# EAGLE design untitled (EAGLE 9.6.2)
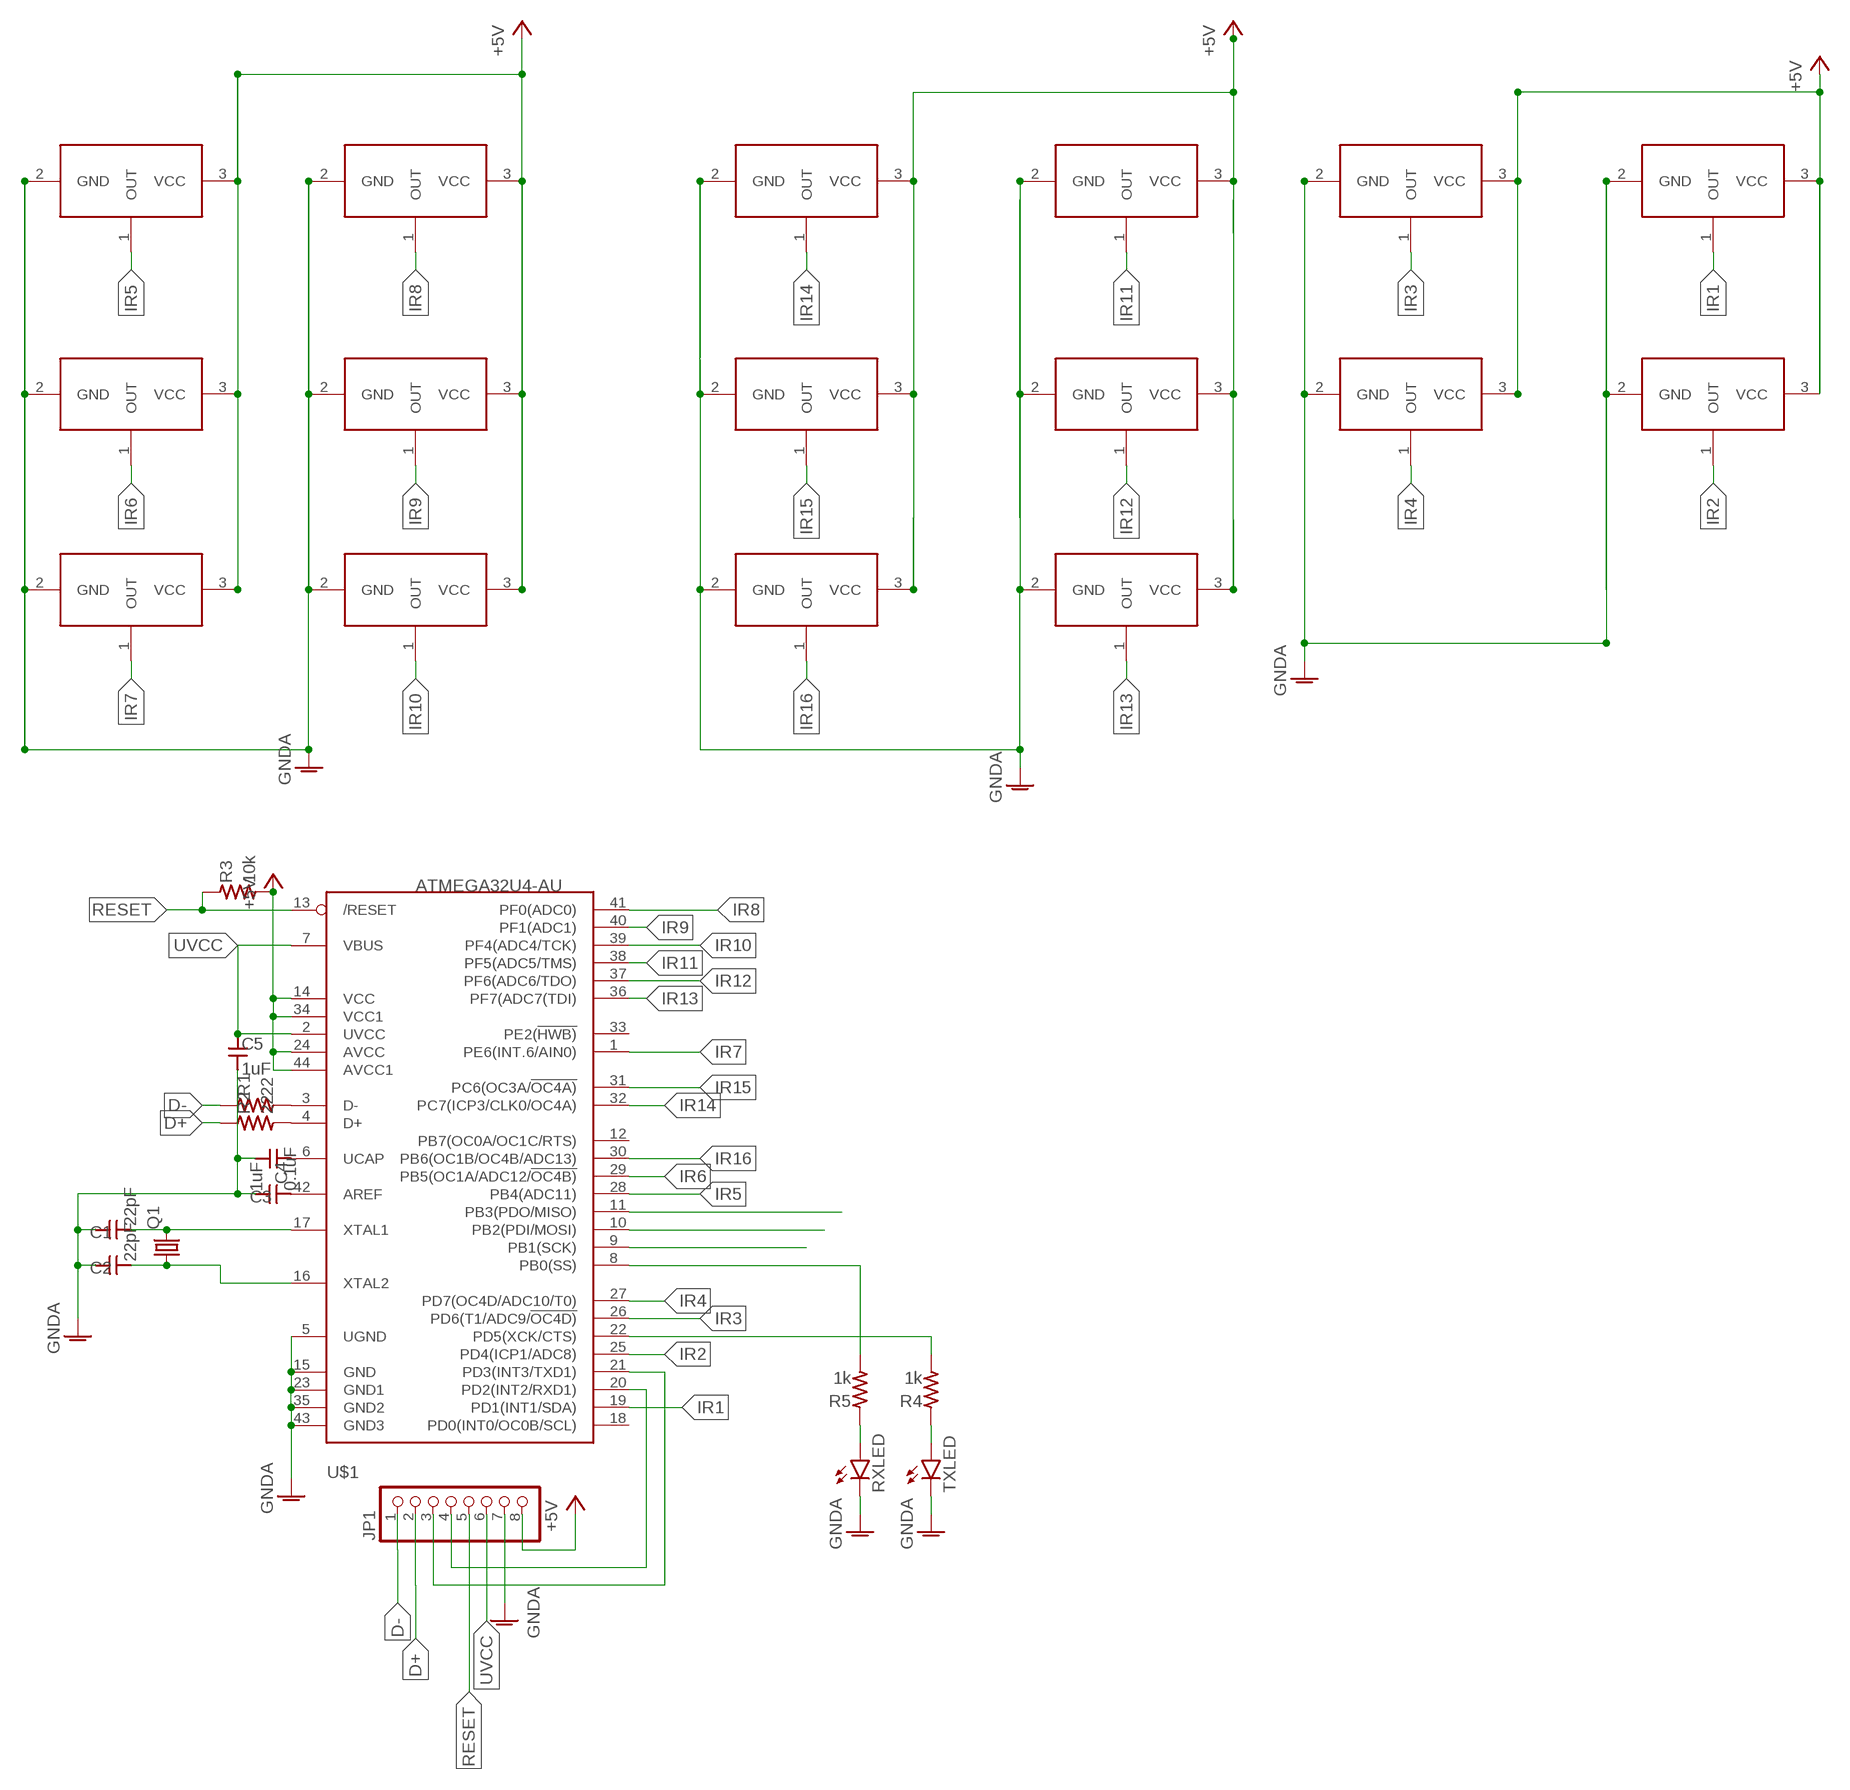
[diagram p0: schematic, sheet 1]

## Parts
C1  22pF  CAPACITOR1608  [SMD1608]
C2  22pF  CAPACITOR1608  [SMD1608]
C3  0.1uF  CAPACITOR1608  [SMD1608]
C4  1uF  CAPACITOR1608  [SMD1608]
C5  1uF  CAPACITOR1608  [SMD1608]
IR1  IRM2121-A538  [IRM_V]
IR2  IRM2121-A538  [IRM_V]
IR3  IRM2121-A538  [IRM_V]
IR4  IRM2121-A538  [IRM_V]
IR5  IRM2121-A538  [IRM_V]
IR6  IRM2121-A538  [IRM_V]
IR7  IRM2121-A538  [IRM_V]
IR8  IRM2121-A538  [IRM_V]
IR9  IRM2121-A538  [IRM_V]
IR10  IRM2121-A538  [IRM_V]
IR11  IRM2121-A538  [IRM_V]
IR12  IRM2121-A538  [IRM_V]
IR13  IRM2121-A538  [IRM_V]
IR14  IRM2121-A538  [IRM_V]
IR15  IRM2121-A538  [IRM_V]
IR16  IRM2121-A538  [IRM_V]
JP1  PINHD-1X8BIG  [1X08-BIG]
Q1  CRYSTALHC49S  [HC49/S]
R1  22  RESISTOR-US1608  [SMD1608]
R2  22  RESISTOR-US1608  [SMD1608]
R3  10k  RESISTOR-US1608  [SMD1608]
R4  1k  RESISTOR-US1608  [SMD1608]
R5  1k  RESISTOR-US1608  [SMD1608]
RXLED  LEDSML0603  [SML0603]
TXLED  LEDSML0603  [SML0603]
U$1  ATMEGA32U4-AU  [TQFP44]

## Nets
+5V: IR1.3(VCC) IR2.3(VCC) IR3.3(VCC) IR4.3(VCC) IR5.3(VCC) IR6.3(VCC) IR7.3(VCC) IR8.3(VCC) IR9.3(VCC) IR10.3(VCC) IR11.3(VCC) IR12.3(VCC) IR13.3(VCC) IR14.3(VCC) IR15.3(VCC) IR16.3(VCC) JP1.8 R3.2 U$1.14(VCC) U$1.24(AVCC) U$1.34(VCC1) U$1.44(AVCC1)
D+: JP1.2 R2.1
D-: JP1.1 R1.1
GNDA: C1.1 C2.1 C3.1 C4.2 C5.2 IR1.2(GND) IR2.2(GND) IR3.2(GND) IR4.2(GND) IR5.2(GND) IR6.2(GND) IR7.2(GND) IR8.2(GND) IR9.2(GND) IR10.2(GND) IR11.2(GND) IR12.2(GND) IR13.2(GND) IR14.2(GND) IR15.2(GND) IR16.2(GND) JP1.7 RXLED.C TXLED.C U$1.5(UGND) U$1.15(GND) U$1.23(GND1) U$1.35(GND2) U$1.43(GND3)
IR1: IR1.1(OUT) U$1.19(PD1(INT1/SDA))
IR2: IR2.1(OUT) U$1.25(PD4(ICP1/ADC8))
IR3: IR3.1(OUT) U$1.26(PD6(T1/ADC9/!OC4D))
IR4: IR4.1(OUT) U$1.27(PD7(OC4D/ADC10/T0))
IR5: IR5.1(OUT) U$1.28(PB4(ADC11))
IR6: IR6.1(OUT) U$1.29(PB5(OC1A/ADC12/!OC4B))
IR7: IR7.1(OUT) U$1.1(PE6(INT.6/AIN0))
IR8: IR8.1(OUT) U$1.41(PF0(ADC0))
IR9: IR9.1(OUT) U$1.40(PF1(ADC1))
IR10: IR10.1(OUT) U$1.39(PF4(ADC4/TCK))
IR11: IR11.1(OUT) U$1.38(PF5(ADC5/TMS))
IR12: IR12.1(OUT) U$1.37(PF6(ADC6/TDO))
IR13: IR13.1(OUT) U$1.36(PF7(ADC7(TDI))
IR14: IR14.1(OUT) U$1.32(PC7(ICP3/CLK0/OC4A))
IR15: IR15.1(OUT) U$1.31(PC6(OC3A/!OC4A))
IR16: IR16.1(OUT) U$1.30(PB6(OC1B/OC4B/ADC13))
N$2: JP1.4 U$1.20(PD2(INT2/RXD1))
N$3: JP1.3 U$1.21(PD3(INT3/TXD1))
N$4: C3.2 U$1.42(AREF)
N$5: C4.1 U$1.6(UCAP)
N$6: C1.2 Q1.2 U$1.17(XTAL1)
N$7: C2.2 Q1.1 U$1.16(XTAL2)
N$8: R1.2 U$1.3(D-)
N$9: R2.2 U$1.4(D+)
N$11: R4.2 U$1.22(PD5(XCK/CTS))
N$15: R4.1 TXLED.A
N$16: R5.1 RXLED.A
N$24: U$1.9(PB1(SCK))
N$25: U$1.10(PB2(PDI/MOSI))
N$27: U$1.11(PB3(PDO/MISO))
N$44: R5.2 U$1.8(PB0(SS))
RESET: JP1.5 R3.1 U$1.13(/RESET)
UVCC: C5.1 JP1.6 U$1.2(UVCC) U$1.7(VBUS)
Unconnected: U$1.12(PB7(OC0A/OC1C/RTS)) U$1.18(PD0(INT0/OC0B/SCL)) U$1.33(PE2(!HWB))

## Library data of the parts
C1-C5 = generic:CAPACITOR: Generic Capacitor
IR1-IR16 = ir:IRM2121-A538
JP1 = adafruit:PINHD-1X8: PIN HEADER
Q1 = crystal:CRYSTAL: CRYSTAL; OC_FARNELL: 1667008; OC_NEWARK: unknown
R1-R5 = generic:RESISTOR-US: Generic Registor
RXLED TXLED = led:LED: LED OSRAM: - CHIPLED LG R971, LG N971, LY N971, LG Q971, LY Q971, LO R971, LY R971 LH N974, LH R974 LS Q976, LO Q976, LY Q976 LO Q996 - Hyper CHIPLED LW Q18S LB Q993, LB Q99A, LB R99A - SideLED LS A670, LO A670, LY A670, LG A670, LP A670 LB A673, LV A673, LT A673, LW A673 LH A674 LY A675 LS A676, LA A676, LO A676, LY A676, LW A676 LS A679, LY A679, LG A679 - Hyper Micro SIDELED® LS Y876, LA Y876, LO Y876, LY Y876 LT Y87S - SmartLED LW L88C, LW L88S LB L89C, LB L89S, LG L890 LS L89K, LO L89K, LY L89K LS L896, LA L896, LO L896, LY L896 - TOPLED LS T670, LO T670, LY T670, LG T670, LP T670 LSG T670, LSP T670, LSY T670, LOP T670, LYG T670 LG T671, LOG T671, LSG T671 LB T673, LV T673, LT T673, LW T673 LH T674 LS T676, LA T676, LO T676, LY T676, LB T676, LH T676, LSB T676, LW T676 LB T67C, LV T67C, LT T67C, LS T67K, LO T67K, LY T67K, LW E67C LS E67B, LA E67B, LO E67B, LY E67B, LB E67C, LV E67C, LT E67C LW T67C LS T679, LY T679, LG T679 LS T770, LO T770, LY T770, LG T770, LP T770 LB T773, LV T773, LT T773, LW T773 LH T774 LS E675, LA E675, LY E675, LS T675 LS T776, LA T776, LO T776, LY T776, LB T776 LHGB T686 LT T68C, LB T68C - Hyper Mini TOPLED® LB M676 - Mini TOPLED Santana® LG M470 LS M47K, LO M47K, LY M47K Source: http://www.osram.convergy.de LUXEON: - LUMILED® LXK2-PW12-R00, LXK2-PW12-S00, LXK2-PW14-U00, LXK2-PW14-V00 LXK2-PM12-R00, LXK2-PM12-S00, LXK2-PM14-U00 LXK2-PE12-Q00, LXK2-PE12-R00, LXK2-PE12-S00, LXK2-PE14-T00, LXK2-PE14-U00 LXK2-PB12-K00, LXK2-PB12-L00, LXK2-PB12-M00, LXK2-PB14-N00, LXK2-PB14-P00, LXK2-PB14-Q00 LXK2-PR12-L00, LXK2-PR12-M00, LXK2-PR14-Q00, LXK2-PR14-R00 LXK2-PD12-Q00, LXK2-PD12-R00, LXK2-PD12-S00 LXK2-PH12-R00, LXK2-PH12-S00 LXK2-PL12-P00, LXK2-PL12-Q00, LXK2-PL12-R00 Source: www.luxeon.com KINGBRIGHT: KA-3528ASYC Source: www.kingbright.com
U$1 = adafruit:ATMEGA32U4: http://www.ladyada.net/library/eagle

## Board
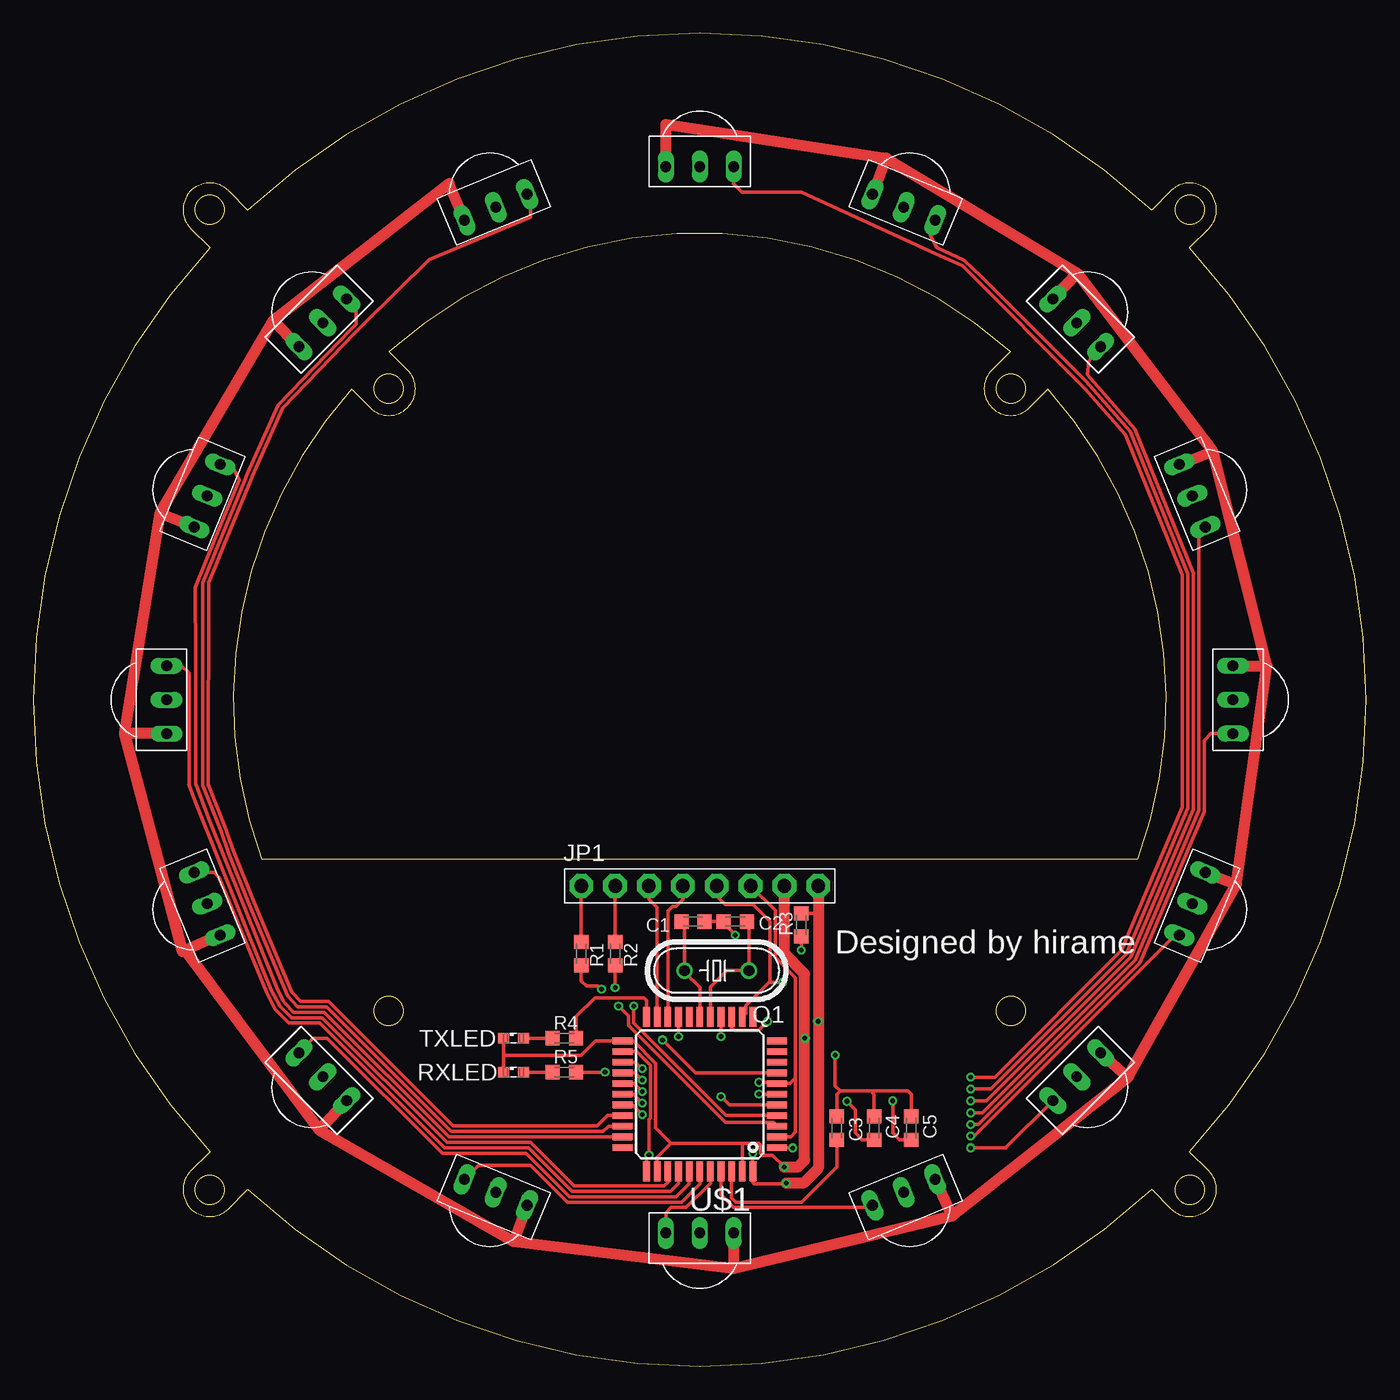
[diagram p1: board, top side]
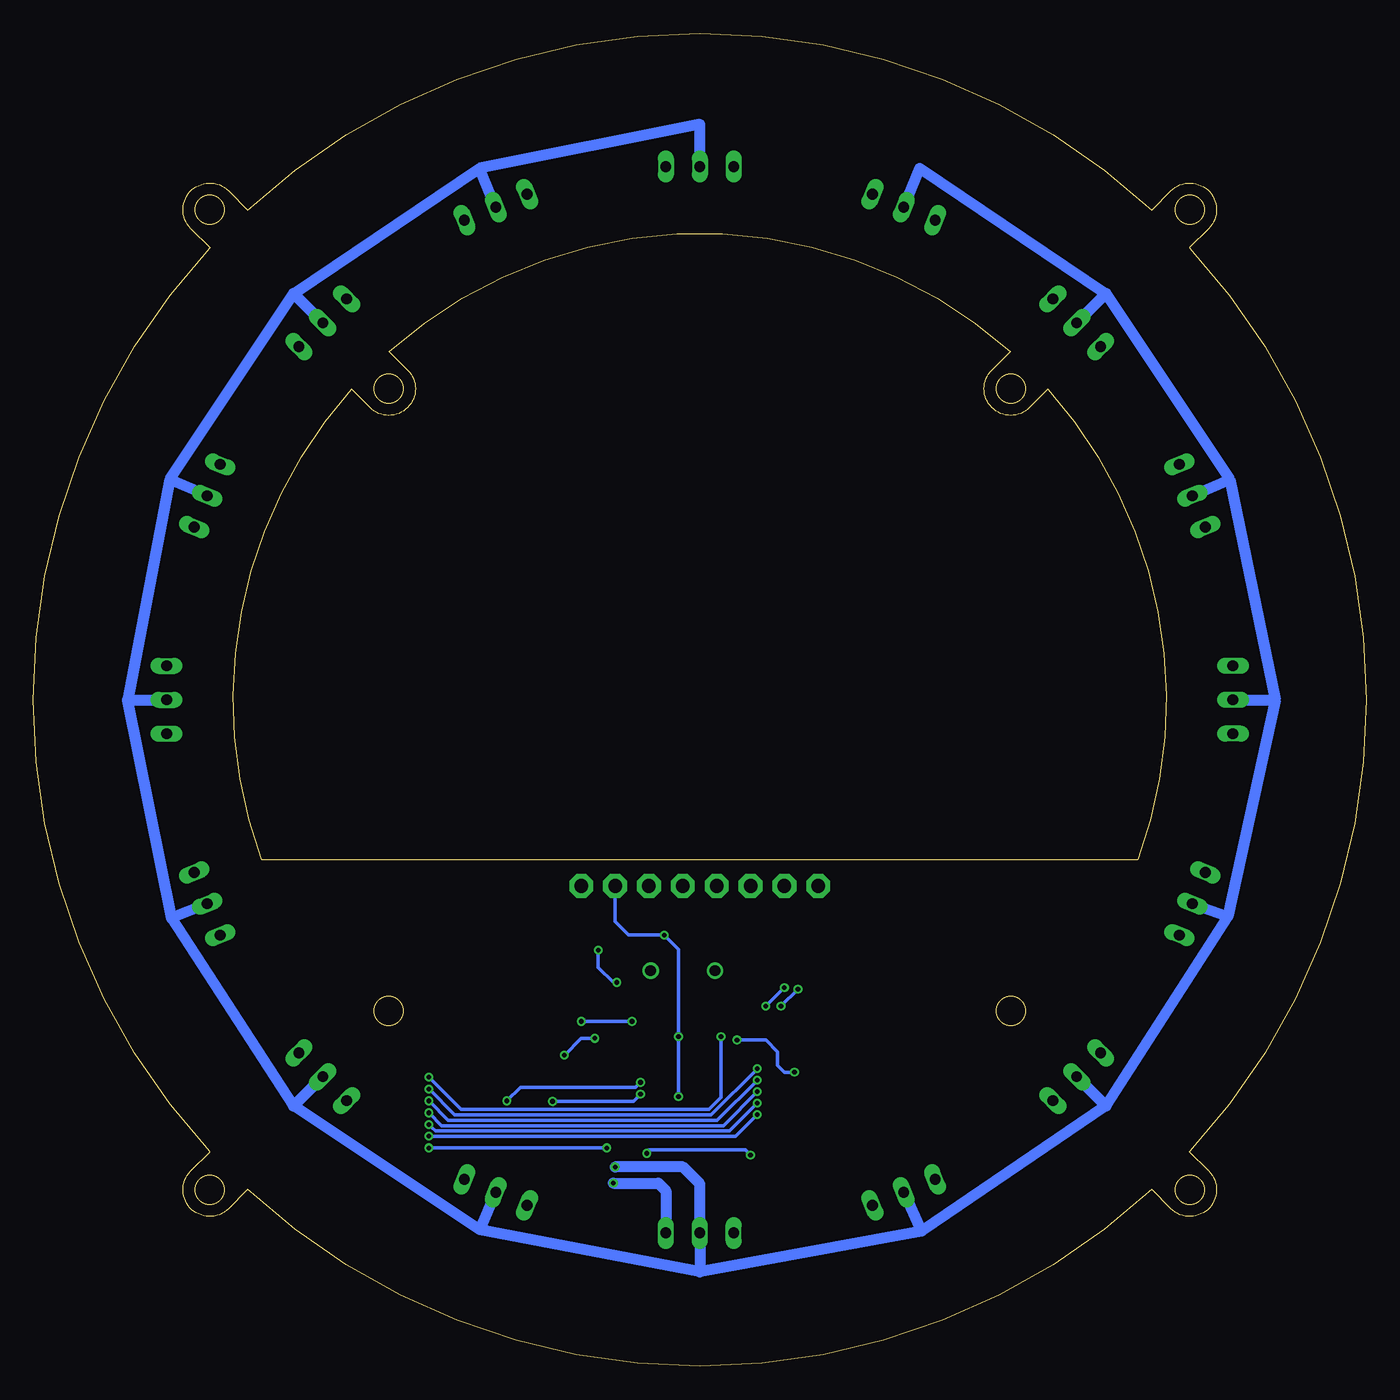
[diagram p2: board, bottom side, seen from below]

Size 100 x 100 mm. Coordinates in mm from the lower left corner, seen from the top.
Outline: 82.88,38 17.12,38 arc-62 23.88,73.29 25.25,71.92 arc180 28.08,74.75 26.71,76.12 arc-83 73.29,76.12 71.92,74.75 arc180 74.75,71.92 76.12,73.29 arc-62 82.88,38
Outline: 86.74,16.09 arc85 86.74,83.91 88.18,85.36 arc180 85.36,88.18 83.91,86.74 arc85 16.09,86.74 14.65,88.18 arc180 11.82,85.36 13.26,83.91 arc85 13.26,16.09 11.82,14.65 arc180 14.65,11.82 16.09,13.26 arc85 83.91,13.26 85.36,11.82 arc180 88.18,14.65 86.74,16.09
Outline: circle at 73.33,73.33 radius 1.1
Outline: circle at 26.67,73.33 radius 1.1
Outline: circle at 73.33,26.67 radius 1.1
Outline: circle at 26.67,26.67 radius 1.1
Outline: circle at 86.77,86.77 radius 1.1
Outline: circle at 86.77,13.23 radius 1.1
Outline: circle at 13.23,13.23 radius 1.1
Outline: circle at 13.23,86.77 radius 1.1
Copper layers (1*16): Top 0.035mm / dielectric 1.6mm / Bottom 0.035mm
Design rules "Elecrow_2-layer_PCB_eagle_rule": minimum track width 6mil, minimum drill 12mil, track to track 6mil, track to pad 6mil, pad to pad 6mil, via to via 8mil, smd to smd 0mil, copper to edge 20mil, drill to drill 10mil, minimum pad ring 6mil, minimum via ring 6mil, stop-mask expansion 0mil, vias tented up to drill 100mil, thermal gap 10mil

### Footprints (pad centres in the part's own frame; a part is rotated, then mirrored left to right if it is on the bottom)
SMD1608 = smd 1.05 x 1.08: 1 -0.875,0; 2 0.875,0
IRM_V = drill 0.8 long: 1 -2.54,0; 2 0,0; 3 2.54,0
1X08-BIG = drill 1.016 pad 1.778 octagon: 1 -8.89,0; 2 -6.35,0; 3 -3.81,0; 4 -1.27,0; 5 1.27,0; 6 3.81,0; 7 6.35,0; 8 8.89,0
HC49/S = drill 0.813: 1 -2.413,0; 2 2.413,0
SML0603 = smd 0.8 x 0.8: A 0.75,0; C -0.75,0
TQFP44 = smd 1.5 x 0.5: 1 -5.8,4; 2 -5.8,3.2; 3 -5.8,2.4; 4 -5.8,1.6; 5 -5.8,0.8; 6 -5.8,0; 7 -5.8,-0.8; 8 -5.8,-1.6; 9 -5.8,-2.4; 10 -5.8,-3.2; 11 -5.8,-4; 23 5.8,-4; 24 5.8,-3.2; 25 5.8,-2.4; 26 5.8,-1.6; 27 5.8,-0.8; 28 5.8,0; 29 5.8,0.8; 30 5.8,1.6; 31 5.8,2.4; 32 5.8,3.2; 33 5.8,4 | smd 0.5 x 1.5: 12 -4,-5.8; 13 -3.2,-5.8; 14 -2.4,-5.8; 15 -1.6,-5.8; 16 -0.8,-5.8; 17 0,-5.8; 18 0.8,-5.8; 19 1.6,-5.8; 20 2.4,-5.8; 21 3.2,-5.8; 22 4,-5.8; 34 4,5.8; 35 3.2,5.8; 36 2.4,5.8; 37 1.6,5.8; 38 0.8,5.8; 39 0,5.8; 40 -0.8,5.8; 41 -1.6,5.8; 42 -2.4,5.8; 43 -3.2,5.8; 44 -4,5.8

### Placement (x,y rotation side)
C1  49.49,33.36 180 top
C2  52.67,33.36 0 top
C3  60.29,17.87 270 top
C4  63.08,17.87 90 top
C5  65.88,17.87 90 top
IR1  50,90 180 top
IR2  65.31,86.96 157.5 top
IR3  78.28,78.28 135 top
IR4  86.96,65.31 112.5 top
IR5  90,50 90 top
IR6  86.96,34.69 67.5 top
IR7  78.28,21.72 45 top
IR8  65.31,13.04 22.5 top
IR9  50,10 0 top
IR10  34.69,13.04 337.5 top
IR11  21.72,21.72 315 top
IR12  13.04,34.69 292.5 top
IR13  10,50 270 top
IR14  13.04,65.31 247.5 top
IR15  21.72,78.28 225 top
IR16  34.69,86.96 202.5 top
JP1  50,36.03 0 top
Q1  51.27,29.68 180 top
R1  41.11,30.95 270 top
R2  43.65,30.95 270 top
R3  57.62,33.11 90 top
R4  39.84,24.6 0 top
R5  39.84,22.06 0 top
RXLED  36.03,22.06 0 top
TXLED  36.03,24.6 0 top
U$1  50,20.41 180 top

### Tracks (layer width: path | path; a pad name or v marks a point on that pad's centre or on a via)
+5V  (via drill 0.35)
  Top 0.254: v56.48,13.73 56.43,13.68 54.06,13.68 54,13.74 U$1.44 53.97,14.64 v53.97,15.96 | U$1.34 46,15.65 v46.19,15.84 | v46.19,15.84 | v46.19,15.84 46.19,18.54 46.29,18.63 46.29,22.57 45.25,23.61 U$1.24 | U$1.14 52.4,25.38 52.6,25.18 54.39,25.18 v55.08,25.87 | R3.2 58.88,33.98 58.89,34
  Top 0.813: IR1.3 47.46,93.18 63.97,90.64 | 63.97,90.64 IR2.3 | IR3.3 78.32,82 | 78.32,82 63.97,90.64 | IR4.3 88.48,68.67 | 88.48,68.67 78.32,82 | IR5.3 92.55,52.54 | 92.55,52.54 88.48,68.67 | IR6.3 90.26,36.16 | 90.26,36.16 92.55,52.54 | IR7.3 82.13,21.68 | 82.13,21.68 82.2,21.81 90.26,36.16 | IR8.3 68.92,11.27 | 68.92,11.27 82.13,21.68 | IR9.3 52.54,7.33 | 52.54,7.33 68.92,11.27 | IR10.3 36.03,9.36 | 36.03,9.36 52.54,7.33 | IR11.3 21.43,17.74 | 21.43,17.74 36.03,9.36 | IR12.3 11.39,31.2 | 11.39,31.2 11.18,31.11 6.82,47.46 | 11.39,31.2 21.43,17.74 | IR14.3 9.49,63.97 | IR15.3 18,78.45 | 18,78.45 9.49,63.97 | IR16.3 31.2,88.74 18,78.45 | v56.48,13.73 57.77,13.73 58.89,14.85 v58.89,25.87 58.89,34 JP1.8 | IR13.3 6.82,47.46 | 9.49,63.97 6.82,47.46
  Bottom 0.254: v46.19,15.84 46.57,16.22 53.81,16.22 53.97,16.06 v53.97,15.96 | v55.08,25.87 v58.89,25.87
  Bottom 0.813: v56.48,13.73 53.1,13.73 52.54,13.17 IR9.3
D+
  Top 0.254: JP1.2 R2.1
D-
  Top 0.254: JP1.1 R1.1
GNDA  (via drill 0.35)
  Top 0.254: v56.35,14.95 55.46,15.84 54.7,15.84 54.57,15.96 54.57,16.6 54.45,16.73 53.18,16.73 | U$1.35 46.8,15.69 47.84,16.73 | 53.18,16.73 47.84,16.73 | 53.18,16.73 53.2,16.7 U$1.43 | 47.84,16.73 46.7,17.87 46.7,22.74 45.02,24.41 U$1.23 42.19,24.41 41.11,23.33 35.28,23.33 | U$1.15 v51.6,24.73 | v51.6,20.23 52.22,19.61 U$1.5 | C3.1 60.29,20.41 60.54,20.66 | 62.83,20.66 60.54,20.66 | 62.83,20.66 63.08,20.41 C4.2 | C1.1 C2.1 51.79,33.22 v52.67,32.35 | 62.83,20.66 65.62,20.66 65.88,20.41 C5.2 | TXLED.C 35.28,23.33 | 35.28,23.33 RXLED.C | 60.54,20.66 60.16,21.04 v60.16,23.33
  Top 0.813: v56.35,14.95 57.37,14.95 57.87,15.46 v57.87,24.6 57.87,29.43 56.35,30.95 JP1.7
  Bottom 0.254: v51.6,20.23 v51.6,24.73 51.6,31.28 v52.67,32.35 55.33,32.35 56.35,33.36 JP1.7 | v60.16,23.33 58.89,24.6 v57.87,24.6
  Bottom 0.813: 92.93,50 IR5.2 | 66.51,89.88 50,93.18 IR1.2 | IR2.2 66.51,89.88 | IR3.2 80.48,80.48 | 80.48,80.48 66.51,89.88 | IR4.2 89.75,66.51 | 89.75,66.51 80.48,80.48 | 89.75,66.51 92.93,50 | IR6.2 89.62,33.62 | 89.62,33.62 92.93,50 | IR7.2 80.48,19.52 | 80.48,19.52 89.62,33.62 | IR8.2 66.51,10.25 | 66.51,10.25 80.48,19.52 | 50,7.07 IR9.2 50,13.68 51.27,14.95 v56.35,14.95 | 50,7.07 66.51,10.25 | IR10.2 33.36,10.12 | 33.36,10.12 50,7.07 | IR11.2 19.52,19.52 | 19.52,19.52 33.36,10.12 | IR12.2 10.38,33.74 | 10.38,33.74 19.52,19.52 | IR14.2 10.25,66.51 | IR15.2 19.52,80.48 | 19.52,80.48 10.25,66.51 | IR16.2 33.49,89.88 19.52,80.48 | IR13.2 6.82,50 | 6.82,50 10.38,33.74 | 10.25,66.51 6.82,50
IR1  (via drill 0.35)
  Top 0.254: U$1.19 v48.4,24.73 | v70.32,21.68 72.15,21.68 81.65,31.18 86.22,41.95 86.22,59.37 81.94,69.89 78.9,73.36 69.71,82.55 67.68,83.45 57.62,88.1 53.18,88.1 52.54,88.74 IR1.1
  Bottom 0.254: v48.4,24.73 48.4,20.17 49.31,19.27 67.91,19.27 v70.32,21.68
IR2  (via drill 0.35)
  Top 0.254: v45.68,22.32 45.19,22.81 U$1.25 | v70.32,20.79 71.83,20.79 81.99,30.95 86.63,41.87 86.63,59.45 82.29,70.1 78.96,73.91 78.87,74 | 78.87,74 | 78.87,74 71.12,81.75 69.83,83 67.78,83.91 67.32,84.83 IR2.1
  Bottom 0.254: v45.68,22.32 49.14,18.86 68.39,18.86 v70.32,20.79
IR3  (via drill 0.35)
  Top 0.254: U$1.26 45.13,22.01 v45.68,21.46 | v70.32,19.9 71.52,19.9 82.33,30.72 87.03,41.78 87.03,59.53 82.64,70.32 79.08,74.38 79.21,75.4 IR3.1
  Bottom 0.254: v45.68,21.46 48.69,18.45 68.87,18.45 v70.32,19.9
IR4  (via drill 0.35)
  Top 0.254: U$1.27 45.07,21.21 v45.68,20.6 | v70.32,19.01 71.2,19.01 82.68,30.49 87.44,41.7 87.44,62.47 IR4.1
  Bottom 0.254: v45.68,20.6 48.24,18.05 60.16,18.05 69.36,18.05 v70.32,19.01
IR5  (via drill 0.35)
  Top 0.254: U$1.28 45.02,20.41 v45.68,19.74 | v70.32,18.13 70.89,18.13 83.02,30.26 87.85,41.62 87.85,46.95 88.35,47.46 IR5.1
  Bottom 0.254: v45.68,19.74 47.79,17.64 69.83,17.64 70.07,17.88 | 70.07,17.88 | 70.07,17.88 v70.32,18.13
IR6  (via drill 0.35)
  Top 0.254: U$1.29 44.96,19.61 v45.68,18.89 | v70.32,17.27 70.61,17.27 85.69,32.35 IR6.1
  Bottom 0.254: v45.68,18.89 47.33,17.23 70.32,17.23 v70.32,17.27
IR7  (via drill 0.35)
  Top 0.254: IR7.1 72.98,16.41 72.98,16.37 v70.32,16.37 | U$1.1 55.84,16.37 v56.99,16.37
  Bottom 0.254: v56.99,16.37 v70.32,16.37
IR8
  Top 0.254: U$1.41 51.6,12.84 52.54,11.9 62.79,11.9 IR8.1
IR9
  Top 0.254: IR9.1 47.46,11.52 47.84,11.9 48.98,11.9 50.8,13.72 U$1.40
IR10
  Top 0.254: U$1.39 50,13.68 48.63,12.31 40.07,12.31 37.3,15.08 33.4,15.08 IR10.1
IR11
  Top 0.254: U$1.38 49.2,13.69 48.22,12.71 40.24,12.71 36.99,15.96 30.7,15.96 22.06,24.6 21.01,24.6 IR11.1
IR12
  Top 0.254: U$1.37 48.4,13.73 47.79,13.12 40.41,13.12 37.15,16.37 30.86,16.37 21.49,25.74 19.15,25.74 18.14,26.76 17.49,28.03 13.93,36.67 13.56,37.04 IR12.1
IR13
  Top 0.254: U$1.36 47.6,13.79 47.33,13.53 40.57,13.53 37.32,16.78 31.03,16.78 21.66,26.15 19.37,26.15 18.52,27 17.84,28.24 17.21,29.77 12.15,42.38 11.68,43.56 | 11.65,43.65 11.68,43.56 | 11.68,43.56 11.68,52 11.14,52.54 IR13.1
IR14
  Top 0.254: U$1.32 31.18,17.21 21.83,26.56 19.54,26.56 18.84,27.25 18.75,27.41 18.25,28.41 13.17,41.11 12.18,43.73 12.18,53.09 12.17,53.08 12.15,58.43 13.55,61.94 15.43,66.47 15.08,67.27 IR14.1
IR15
  Top 0.254: U$1.31 43.16,18.01 42.76,17.62 31.34,17.62 22,26.96 19.83,26.96 19.08,27.78 16.2,34.63 14.66,38.47 14.08,40.1 12.75,43.48 12.71,43.57 12.71,52.8 12.71,58.75 13.93,61.79 15.86,66.45 16.05,66.92 18.38,72.1 23.84,77.81 24.22,78.19 24.22,79.34 IR15.1
IR16
  Top 0.254: U$1.30 43.07,18.81 42.28,18.02 31.51,18.02 22.17,27.37 20.05,27.37 19.4,28.09 16.58,34.79 15.04,38.62 14.52,40.09 14.52,40.1 14.46,40.25 14.41,40.4 14.4,40.4 13.19,43.48 13.12,43.66 13.12,44.16 13.17,58.79 13.64,59.97 | 13.64,59.97 | 13.64,59.97 14.3,61.63 16.3,66.45 16.43,66.75 18.72,71.87 24.13,77.53 24.82,78.22 29.68,83.02 37.3,86.2 37.3,87.08 IR16.1
N$2
  Top 0.254: JP1.4 48.73,35.01 48.22,34.51 47.97,34.51 47.6,34.14 U$1.20
N$3
  Top 0.254: JP1.3 46.19,35.01 46.8,34.4 U$1.21
N$4
  Top 0.254: U$1.42 52.4,12.62 52.71,12.31 57.62,12.31 60.29,14.97 C3.2
N$5  (via drill 0.35)
  Top 0.254: U$1.6 v54.45,20.41 | v61.05,19.87 61.68,19.24 61.68,17.49 62.18,16.99 C4.1
  Bottom 0.254: v54.45,20.41 54.98,19.87 v61.05,19.87
N$6
  Top 0.254: C1.2 48.86,33.12 Q1.2 48.86,29.55 50,28.41 U$1.17
N$7
  Top 0.254: C2.2 53.68,33.22 Q1.1 52.03,29.68 50.8,28.45 U$1.16
N$8  (via drill 0.35)
  Top 0.254: U$1.3 55.53,18.28 51.94,18.28 44.64,25.58 44.64,26.28 v43.9,27.01 | v42.63,28.28 42.38,28.54 41.49,28.54 41.11,28.92 R1.2
  Bottom 0.254: v43.9,27.01 v42.63,28.28
N$9  (via drill 0.35)
  Top 0.254: U$1.4 51.98,18.81 45.05,25.74 v45.05,27.01 | v43.65,28.41 R2.2
  Bottom 0.254: v45.05,27.01 v43.65,28.41
N$11
  Top 0.254: R4.2 40.72,26.24 42.13,27.65 45.81,27.65 46,27.46 U$1.22
N$15
  Top 0.254: TXLED.A R4.1
N$16
  Top 0.254: RXLED.A R5.1
N$44  (via drill 0.35)
  Top 0.254: U$1.8 49.67,22.01 v47.21,24.47 | v42.89,22.06 R5.2
  Bottom 0.254: v47.21,24.47 45.05,24.47 44.16,23.58 44.16,22.57 43.65,22.06 v42.89,22.06
RESET  (via drill 0.35)
  Top 0.254: U$1.13 53.47,26.48 53.47,27.08 54.88,28.48 55.19,28.79 | 55.19,28.79 55.26,28.86 55.26,33.36 53.99,34.63 51.91,34.63 51.27,35.27 JP1.5 | R3.1 v57.62,31.2 | v56.22,28.79 55.19,28.79
  Bottom 0.254: v57.62,31.2 57.62,29.93 56.48,28.79 v56.22,28.79
UVCC  (via drill 0.35)
  Top 0.254: JP1.6 55.66,34.18 55.66,30.67 57.19,29.14 57.19,21.63 | 57.19,21.63 56.77,21.21 U$1.7 55.71,21.3 v54.45,21.3 | 57.19,21.63 57.19,17.56 56.83,17.21 U$1.2 | C5.1 64.97,16.99 64.48,17.49 v64.48,19.9
  Bottom 0.254: v54.45,21.3 54.83,20.92 63.46,20.92 v64.48,19.9

### Text on the board
tNames: Designed by hirame